# EAGLE design GIM-Scehmatic (EAGLE 7.3.0)
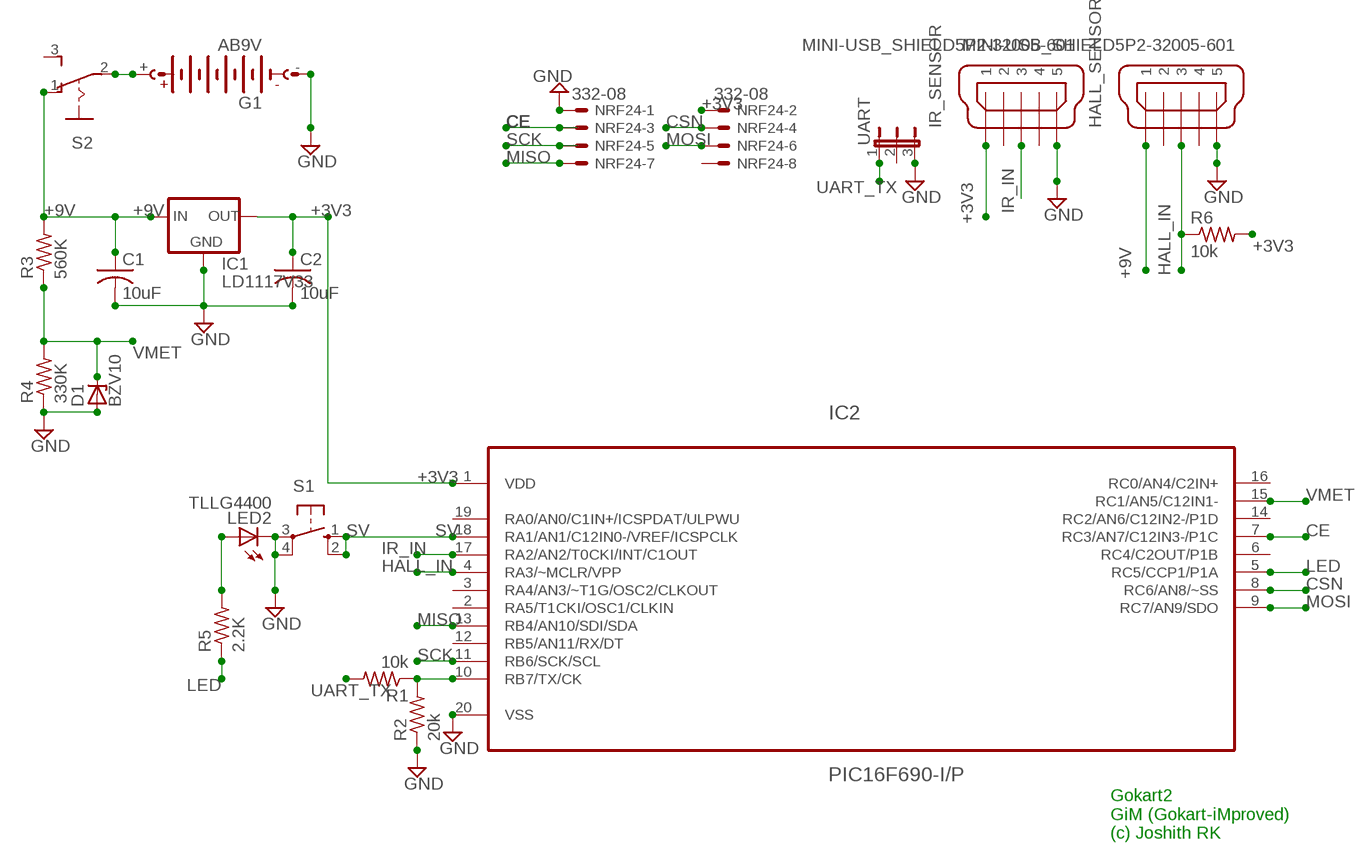
[diagram p0: schematic, sheet 1]

## Parts
C1  10uF  C-US025-040X050  [C025-040X050]
C2  10uF  C-US025-040X050  [C025-040X050]
D1  BZV10  [DO34Z7]
G1  AB9V  [AB9V]
HALL_SENSOR  MINI-USB_SHIELD5P2-32005-601  [32005-601]
IC1  LD1117V33  [LD1117V33]
IC2  PIC16F690-I/P  [DIP254P762X533-20]
IR_SENSOR  MINI-USB_SHIELD5P2-32005-601  [32005-601]
LED2  TLLG4400  [LED3MM]
NRF24  332-08  [332-08]
R1  10k  R-US_0204/7  [0204/7]
R2  20k  R-US_0204/7  [0204/7]
R3  560K  R-US_0204/7  [0204/7]
R4  330K  R-US_0204/7  [0204/7]
R5  2.2K  R-US_0204/7  [0204/7]
R6  10k  R-US_0204/7  [0204/7]
S1  10-XX  [B3F-10XX]
S2  M251  [M251]
UART  JP2E  [JP2]

## Nets
+3V3: C2.1 IC1.OUT IC2.1(VDD) IR_SENSOR.1 NRF24.2 R6.2
+9V: C1.1 HALL_SENSOR.1 IC1.IN R3.2 S2.1(O)
CE: IC2.7(RC3/AN7/C12IN3-/P1C) NRF24.3
CSN: IC2.8(RC6/AN8/~SS) NRF24.4
GND: C1.2 C2.2 D1.A G1.- HALL_SENSOR.5 IC1.GND IC2.20(VSS) IR_SENSOR.5 LED2.K(C) NRF24.1 R2.1 R4.1 S1.3(P) S1.4(P1) UART.3
HALL_IN: HALL_SENSOR.3 IC2.4(RA3/~MCLR/VPP) R6.1
IR_IN: IC2.17(RA2/AN2/T0CKI/INT/C1OUT) IR_SENSOR.3
LED: IC2.5(RC5/CCP1/P1A) R5.1
MISO: IC2.13(RB4/AN10/SDI/SDA) NRF24.7
MOSI: IC2.9(RC7/AN9/SDO) NRF24.6
N$1: IC2.10(RB7/TX/CK) R1.1 R2.2
N$2: G1.+ S2.2(P)
N$5: LED2.A R5.2
SCK: IC2.11(RB6/SCK/SCL) NRF24.5
SV: IC2.18(RA1/AN1/C12IN0-/VREF/ICSPCLK) S1.1(S) S1.2(S1)
UART_TX: R1.2 UART.1
VMET: D1.C IC2.15(RC1/AN5/C12IN1-) R3.1 R4.2
Unconnected: HALL_SENSOR.2 HALL_SENSOR.4 HALL_SENSOR.M1(S1) HALL_SENSOR.M2(S2) IC2.2(RA5/T1CKI/OSC1/CLKIN) IC2.3(RA4/AN3/~T1G/OSC2/CLKOUT) IC2.6(RC4/C2OUT/P1B) IC2.12(RB5/AN11/RX/DT) IC2.14(RC2/AN6/C12IN2-/P1D) IC2.16(RC0/AN4/C2IN+) IC2.19(RA0/AN0/C1IN+/ICSPDAT/ULPWU) IR_SENSOR.2 IR_SENSOR.4 IR_SENSOR.M1(S1) IR_SENSOR.M2(S2) NRF24.8 S2.3(S) UART.2

## Notes on the sheet
- Gokart2
  GiM (Gokart-iMproved)
  (c) Joshith RK

## Library data of the parts
C1 C2 = rcl:C-US: CAPACITOR, American symbol
D1 = diode:BZV10: Z DIODE
G1 = battery:AB9V: 9-V BATTERY CLIP
HALL_SENSOR IR_SENSOR = con-cypressindustries:MINI-USB_SHIELD5P2-: MINI USB-B R/A DIP 5pol. Source: www.cypressindustries.com; OC_FARNELL: unknown; OC_NEWARK: unknown
IC1 = LD1117V33:LD1117V33
IC2 = Microchip_By_element14_Batch_1:PIC16F690-I/P: CMOS Microcontrollers; MPN: PIC16F690-I/P; OC_FARNELL: 1103406; OC_NEWARK: -; PACKAGE: DIP-20; SUPPLIER: Microchip
LED2 = led:TLLG4400: Low Current (2mA) LED 3 mm Tinted Diffused Package color GREEN Source: Data sheet <http://www.farnell.com/datasheets/391098.pdf>; MF: VISHAY SEMICONDUCTOR; OC_FARNELL: 1612435
NRF24 = con-garry:332-08: 8 Pin - 2mm Dual Row Source: www.mpe-connector.de / garry_shortform_2012.pdf
R1-R6 = resistor:R-US_: RESISTOR, American symbol
S1 = switch-omron:10-XX: OMRON SWITCH; MPN: B3F-1000; OC_FARNELL: 176432; OC_NEWARK: 36M3542
S2 = switch:M251: SLIDING SWITCH Mors, distributor Buerklin, 11G702
UART = jumper:JP2E: JUMPER

## Net classes
0 default: width 0.305 mm, drill 0.254 mm, clearance 0.305 mm

## Board
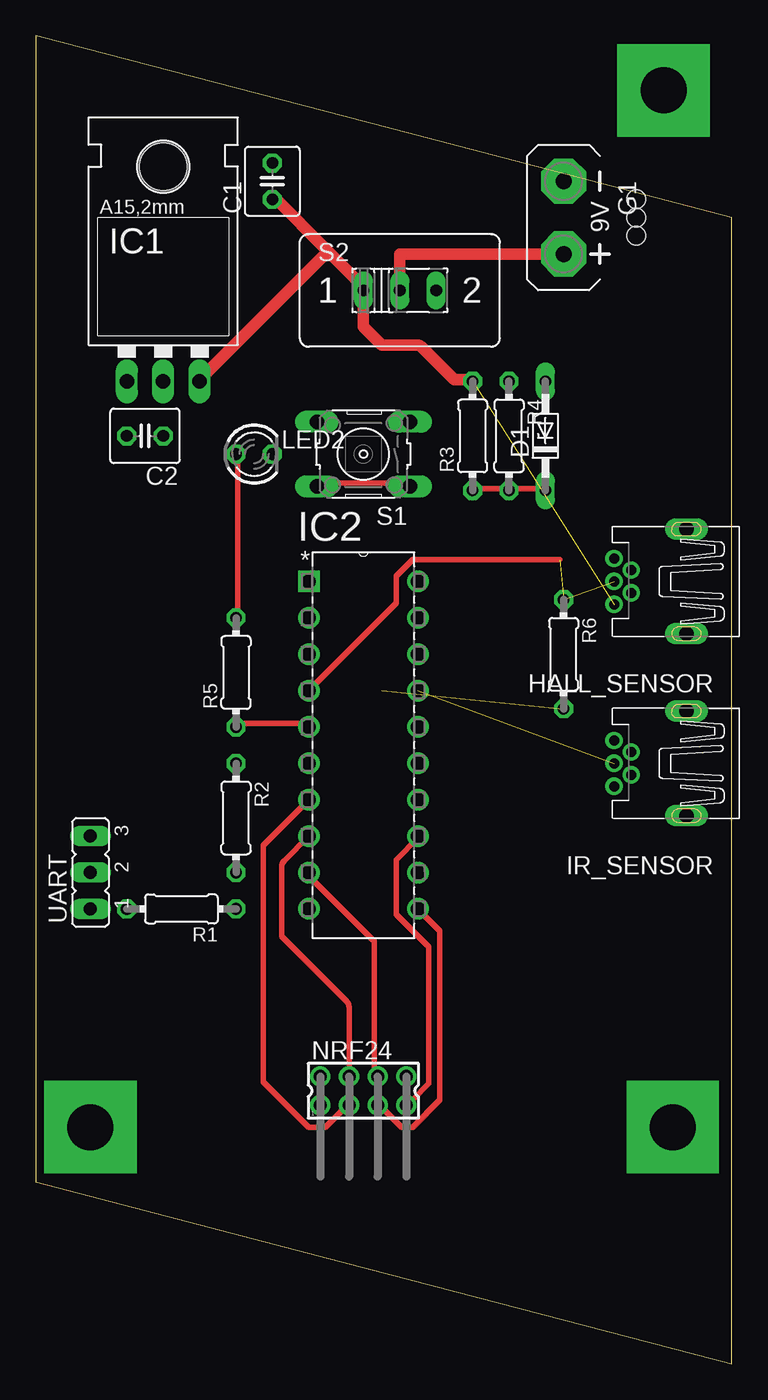
[diagram p1: board, top side]
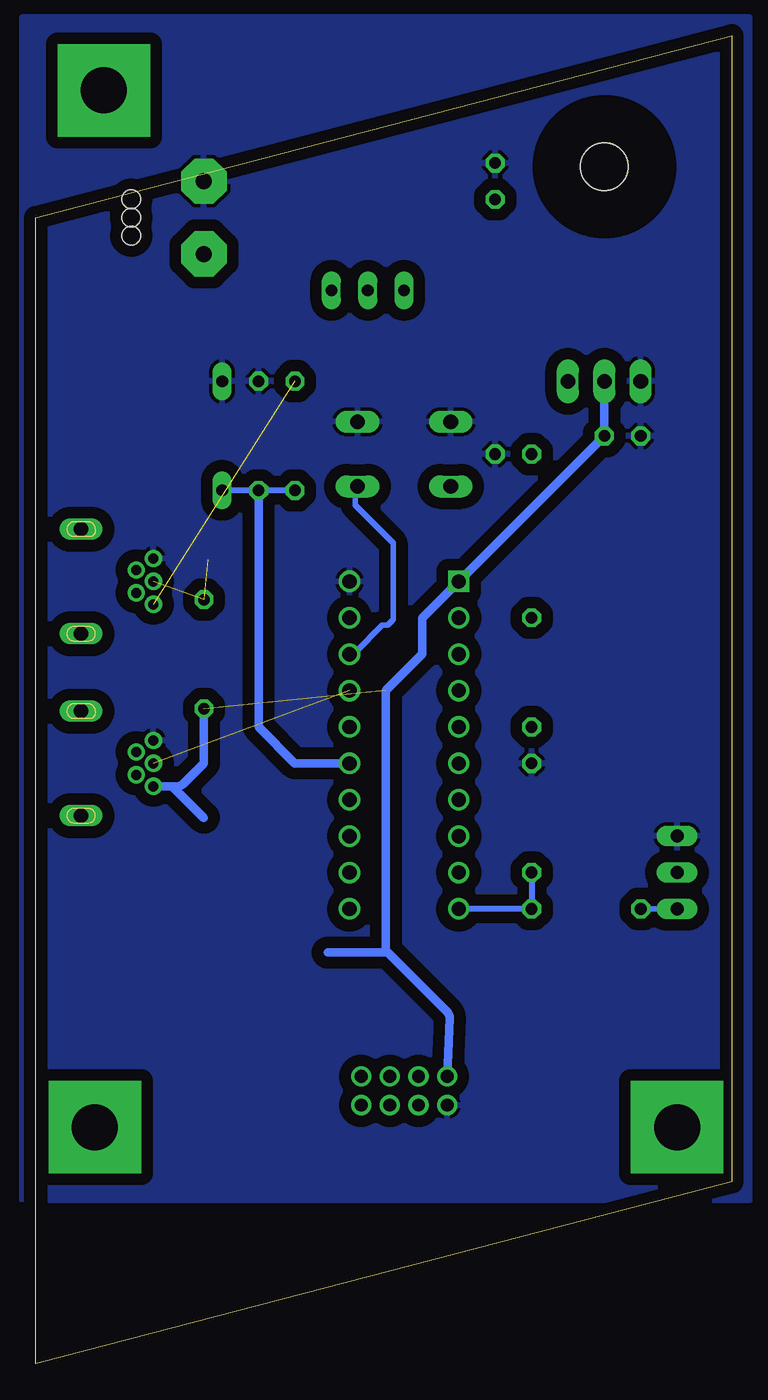
[diagram p2: board, bottom side, seen from below]

Size 48.56 x 92.7 mm. Coordinates in mm from the lower left corner, seen from the top.
Outline: 0,12.7 48.56,0 48.56,80 0,92.7 0,12.7
Copper layers (1*16): Top 0.035mm / dielectric 1.5mm / Bottom 0.035mm
Design rules "default *": minimum track width 15mil, minimum drill 17mil, track to track 15mil, track to pad 15mil, pad to pad 15mil, via to via 8mil, smd to smd 8mil, copper to edge 20mil, drill to drill 8mil, minimum pad ring 10mil, minimum via ring 12mil, stop-mask expansion 14mil, vias tented up to drill 0mil, thermal gap 10mil
Holes 1.3 mm at 41.91,80.01 41.91,78.74 41.91,81.28

### Footprints (pad centres in the part's own frame; a part is rotated, then mirrored left to right if it is on the bottom)
C025-040X050 = drill 0.813 octagon: 1 -1.27,0; 2 1.27,0
DO34Z7 = drill 0.813 long: A 3.81,0; C -3.81,0
AB9V = drill 1.118 pad 3.15 octagon: + 0,2.54; - 0,-2.54
32005-601 = drill 0.7 pad 1.016: 1 2.825,1.6; 2 1.625,0.8; 3 2.825,0; 4 1.625,-0.8; 5 2.825,-1.6 | drill 1 pad 1.422 long: M1 -2.225,3.65; M2 -2.225,-3.65
LD1117V33 = drill 1.016 long: GND -2.54,-8.89; IN 2.54,-8.89; OUT 0,-8.89 | hole 3.302: 0,6.096
DIP254P762X533-20 = drill 0.991 square: 1 -7.62,22.86 | drill 0.991: 2 -7.62,20.32; 3 -7.62,17.78; 4 -7.62,15.24; 5 -7.62,12.7; 6 -7.62,10.16; 7 -7.62,7.62; 8 -7.62,5.08; 9 -7.62,2.54; 10 -7.62,0; 11 0,0; 12 0,2.54; 13 0,5.08; 14 0,7.62; 15 0,10.16; 16 0,12.7; 17 0,15.24; 18 0,17.78; 19 0,20.32; 20 0,22.86
LED3MM = drill 0.813 octagon: A -1.27,0; K 1.27,0
332-08 = drill 0.9 pad 1.27: 1 -3,-1; 2 -3,1; 3 -1,-1; 4 -1,1; 5 1,-1; 6 1,1; 7 3,-1; 8 3,1
0204/7 = drill 0.813 octagon: 1 -3.81,0; 2 3.81,0
B3F-10XX = drill 1.016 long: 1 -3.251,2.261; 2 3.251,2.261; 3 -3.251,-2.261; 4 3.251,-2.261
M251 = drill 0.813 long: 1 -2.54,0; 2 0,0; 3 2.54,0
JP2 = drill 0.914 long: 1 -2.54,0; 2 0,0; 3 2.54,0

### Placement (x,y rotation side)
C1  16.51,82.55 90 top
C2  7.62,64.77 180 top
D1  35.56,64.77 90 top
G1  36.83,80.01 180 top
HALL_SENSOR  43.18,54.61 180 top
IC1  8.89,77.47 0 top
IC2  26.67,31.75 0 top
IR_SENSOR  43.18,41.91 180 top
LED2  15.24,63.5 0 top
NRF24  22.86,19.05 0 top
R1  10.16,31.75 180 top
R2  13.97,38.1 270 top
R3  30.48,64.77 90 top
R4  33.02,64.77 270 top
R5  13.97,48.26 90 top
R6  36.83,49.53 270 top
S1  22.86,63.5 180 top
S2  25.4,74.93 0 top
UART  3.81,34.29 90 top

### Tracks (layer width: path | path; a pad name or v marks a point on that pad's centre or on a via)
+3V3  (1 unrouted)
  Bottom 0.381: 19.43,20.32 19.81,20.32 NRF24.2 | 24.13,28.7 24,28.7
  Bottom 0.61: 28.19,28.7 24.13,28.7 24.13,46.99 21.59,49.53 21.59,52.07 IC2.1 C2.1 IC1.OUT | 24,28.7 19.86,24.56 arc45 19.68,24.13 NRF24.2 | R6.2 36.83,41.91 38.24,40.5 arc45 38.69,40.31 IR_SENSOR.1 39.3,40.31 arc45 38.85,40.12 36.83,38.1
+9V  (1 unrouted)
  Top 0.381: 22.86,75.18 S2.1 22.86,74.8 | 30.48,68.71 R3.2 | 16.76,81.28 C1.1 | 20.19,77.85 20.19,77.47 | 11.43,68.71 IC1.IN
  Top 0.813: 16.76,81.28 20.19,77.85 22.86,75.18 | 20.19,77.47 11.43,68.71 | 22.86,74.8 22.86,72.39 24.13,71.12 26.53,71.12 arc-45 26.98,70.93 29.21,68.71 30.17,68.71 arc-45 R3.2
CE
  Top 0.381: NRF24.3 21.72,18.03 20.19,16.51 19.68,16.51 19.43,16.51 19.05,16.51 15.88,19.68 15.88,36.2 IC2.7
CSN
  Top 0.381: IC2.8 17.33,35.11 arc45 17.14,34.66 17.14,29.84 21.67,25.32 arc-45 21.86,24.87 NRF24.4
GND
  pour Bottom (isolate 0.813, rank 6): -1.27,93.98 49.53,93.98 49.53,11.43 -1.27,11.43
HALL_IN  (2 unrouted)
  Top 0.381: IC2.4 25.15,53.09 25.15,54.99 26.29,56.13 36.58,56.13
IR_IN  (1 unrouted)
LED
  Top 0.381: R5.1 14.1,44.7 19.05,44.7 IC2.5
MISO
  Top 0.381: NRF24.7 25.91,18.41 26.29,18.41 27.43,19.56 27.43,29.08 25.15,31.37 25.15,35.18 26.67,36.7 IC2.13
MOSI
  Top 0.381: NRF24.6 23.62,20.32 23.62,29.46 19.05,34.04 IC2.9
MOUNT1  (via drill 3.2 pad 6.45)
  other vias: 43.81,88.9
MOUNT4  (via drill 3.2 pad 6.45)
  other vias: 44.45,16.51
N$1
  Bottom 0.406: R2.2 R1.1 IC2.10
N$2
  Top 0.813: S2.2 25.4,77.47 G1.+
N$3  (via drill 3.2 pad 6.45)
  other vias: 3.81,16.51
N$5
  Top 0.381: R5.2 14.1,52.32 14.1,63.37 LED2.A
SCK
  Top 0.381: IC2.11 28.19,30.23 28.19,18.41 26.29,16.51 25.53,16.51 24,18.03 NRF24.5
SV
  Top 0.381: S1.2 19.81,61.47 25.91,61.47 S1.1
  Bottom 0.381: IC2.18 26.67,49.66 26.29,49.66 24.38,51.56 24,51.56 23.62,51.94 23.62,57.28 26.29,59.94 26.29,61.09 S1.1
UART_TX
  Bottom 0.381: UART.1 R1.2
VMET
  Top 0.381: R3.1 30.48,61.09 32.77,61.09 R4.2 33.15,61.09 35.43,61.09 D1.C
  Bottom 0.406: R3.1 R4.2 D1.C
  Bottom 0.61: IC2.15 30.48,41.91 33.02,44.45 R4.2